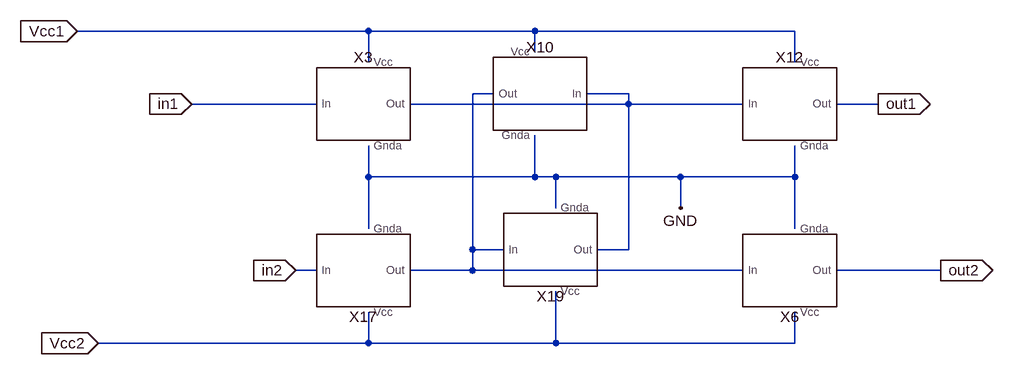
[diagram p0: schematic UNIT.asc]
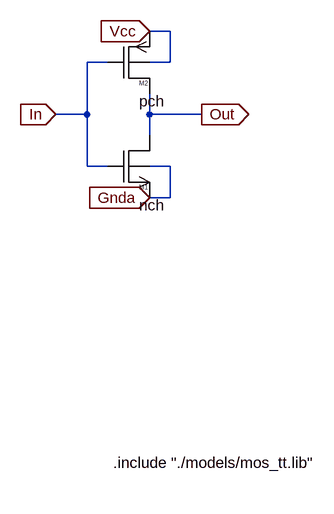
[diagram p1: sub-circuit inverter.asc]
UNIT.asc, the LTspice schematic file:
Version 4
SHEET 1 2512 992
WIRE -1520 -880 -1968 -880
WIRE -1264 -880 -1520 -880
WIRE -864 -880 -1264 -880
WIRE -1264 -848 -1264 -880
WIRE -1520 -832 -1520 -880
WIRE -864 -832 -864 -880
WIRE -1328 -784 -1360 -784
WIRE -1120 -784 -1184 -784
WIRE -1600 -768 -1792 -768
WIRE -1120 -768 -1120 -784
WIRE -1120 -768 -1456 -768
WIRE -944 -768 -1120 -768
WIRE -736 -768 -800 -768
WIRE -1520 -656 -1520 -704
WIRE -1264 -656 -1264 -720
WIRE -1264 -656 -1520 -656
WIRE -1232 -656 -1264 -656
WIRE -1040 -656 -1232 -656
WIRE -864 -656 -864 -704
WIRE -864 -656 -1040 -656
WIRE -1232 -608 -1232 -656
WIRE -1040 -608 -1040 -656
WIRE -1520 -576 -1520 -656
WIRE -864 -576 -864 -656
WIRE -1360 -544 -1360 -784
WIRE -1312 -544 -1360 -544
WIRE -1120 -544 -1120 -768
WIRE -1120 -544 -1168 -544
WIRE -1600 -512 -1632 -512
WIRE -1360 -512 -1360 -544
WIRE -1360 -512 -1456 -512
WIRE -944 -512 -1360 -512
WIRE -640 -512 -800 -512
WIRE -1520 -400 -1520 -448
WIRE -1520 -400 -1936 -400
WIRE -1232 -400 -1232 -480
WIRE -1232 -400 -1520 -400
WIRE -864 -400 -864 -448
WIRE -864 -400 -1232 -400
FLAG -1968 -880 Vcc1
IOPIN -1968 -880 In
FLAG -1792 -768 in1
IOPIN -1792 -768 In
FLAG -736 -768 out1
IOPIN -736 -768 Out
FLAG -1632 -512 in2
IOPIN -1632 -512 In
FLAG -640 -512 out2
IOPIN -640 -512 Out
FLAG -1040 -608 GND
FLAG -1936 -400 Vcc2
IOPIN -1936 -400 In
SYMBOL inverter -1536 -768 R0
SYMATTR InstName X3
SYMBOL inverter -880 -512 M180
SYMATTR InstName X6
SYMBOL inverter -880 -768 R0
SYMATTR InstName X12
SYMBOL inverter -1536 -512 M180
SYMATTR InstName X17
SYMBOL inverter -1248 -784 M0
SYMATTR InstName X10
SYMBOL inverter -1248 -544 M180
SYMATTR InstName X19

inverter.asc, the sub-circuit schematic file:
Version 4
SHEET 1 880 696
WIRE 192 16 160 16
WIRE 96 64 64 64
WIRE 192 64 192 16
WIRE 192 64 160 64
WIRE 64 144 64 64
WIRE 64 144 16 144
WIRE 160 144 160 112
WIRE 240 144 160 144
WIRE 160 176 160 144
WIRE 64 224 64 144
WIRE 96 224 64 224
WIRE 192 224 160 224
WIRE 192 272 192 224
WIRE 192 272 160 272
FLAG 16 144 In
IOPIN 16 144 In
FLAG 240 144 Out
IOPIN 240 144 Out
FLAG 160 16 Vcc
IOPIN 160 16 In
FLAG 160 272 Gnda
IOPIN 160 272 In
SYMBOL nmos4 96 224 R0
WINDOW 3 48 60 Left 2
SYMATTR InstName M1
SYMATTR Value nch
SYMATTR Value2 l=2u w=6u
SYMBOL pmos4 96 64 R0
WINDOW 3 48 60 Left 2
SYMATTR InstName M2
SYMATTR Value pch
SYMATTR Value2 l=2u w=18u
TEXT 104 680 Left 2 !.include "./models/mos_tt.lib"\n

The netlist it stands for:
* UNIT.asc
XX3 GND in1 Vcc1 N002 inverter
XX6 GND N001 Vcc2 out2 inverter
XX12 GND N002 Vcc1 out1 inverter
XX17 GND in2 Vcc2 N001 inverter
XX10 GND N002 Vcc1 N001 inverter
XX19 GND N001 Vcc2 N002 inverter

* block symbol definitions
.subckt inverter Gnda In Vcc Out
M1 Out In Gnda Gnda nch l=2u w=6u
M2 Out In Vcc Vcc pch l=2u w=18u
.include "./models/mos_tt.lib"
.ends inverter

.model NMOS NMOS
.model PMOS PMOS
.lib standard.mos
.backanno
.end